# Altium schematic sheet Sheet2.SchDoc
size A; SheetNumber: 1; SheetTotal: 1
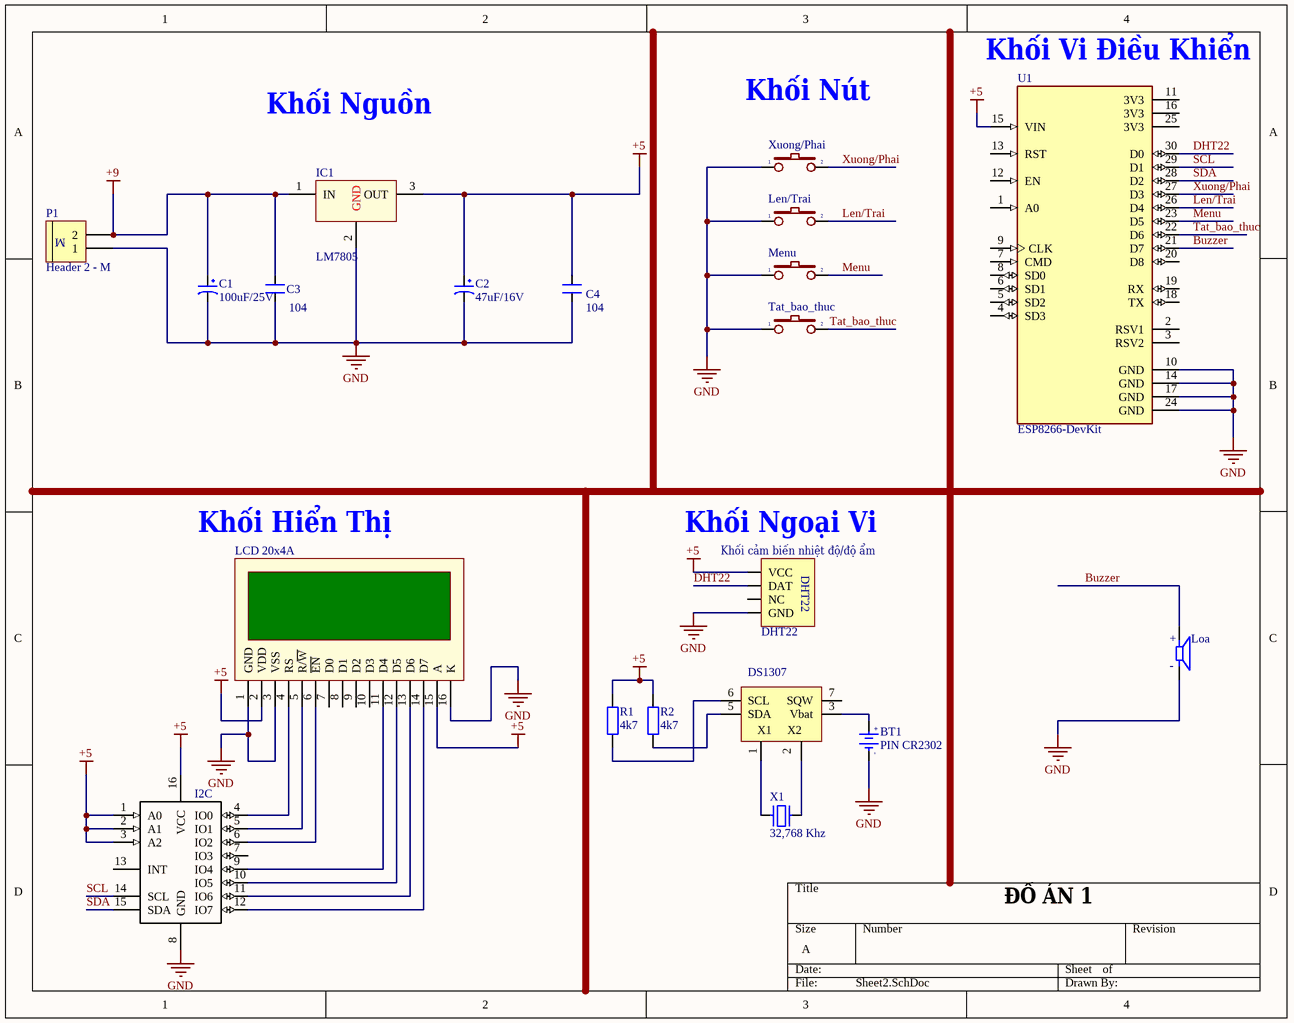
[diagram p0: Sheet2.SchDoc]

## Parts
(Parts that share a designator on the sheet are numbered #1, #2 ... from top to bottom, then left to right.)
?#1  LCD 20x4A  [LCD20X4A]
?#2  DS1307  [DIP8/W0.3]
BT1  PIN CR2302  [PIN3V]
C1  100uF/25V  [CP1.5/3.4]
C2  47uF/16V  [CP1.5/3.4]
C3  104  [CN1]
C4  104  [CN1]
I2C  (no value)  [DIP16]
IC1  LM7805  [QTO-220]
Khối_cảm_biến_nhiệt_độ/độ_ẩm  DHT22  [DHT22]
Len/Trai  (no value)  [SW2]
Loa  (no value)  [Buzzer-12MM]
Menu  (no value)  [SW2]
P1  Header 2 - M  [Medium - Header 2]
R1  4k7  [R1/4W]
R2  4k7  [R1/4W]
Tat_bao_thuc  (no value)  [SW2]
U1  ESP8266-DevKit  [ESP8266-DEVKIT]
X1  32,768 Khz  [XT32k]
Xuong/Phai  (no value)  [SW2]

## Nets
+5: ?#1.2(VDD) ?#1.15(A) C2.1 C4.1 I2C.1(A0) I2C.2(A1) I2C.3(A2) I2C.16(VCC) IC1.3(OUT) Khối_cảm_biến_nhiệt_độ/độ_ẩm.1(VCC) R1.2 R2.2 U1.15(VIN)
+9: C1.1 C3.1 IC1.1(IN) P1.2
GND: ?#1.1(GND) ?#1.3(VSS) ?#1.16(K) ?#2.4(GND) BT1.2(GND) C1.2 C2.2 C3.2 C4.2 I2C.8(GND) IC1.2(GND) Khối_cảm_biến_nhiệt_độ/độ_ẩm.4(GND) Len/Trai.1 Loa.2(M) Menu.1 P1.1 Tat_bao_thuc.1 U1.10(GND) U1.14(GND) U1.17(GND) U1.24(GND) Xuong/Phai.1
VCC: ?#2.8(VCC)
Buzzer: Loa.1(P) U1.21(D7)
DHT22: Khối_cảm_biến_nhiệt_độ/độ_ẩm.2(DAT) U1.30(D0)
Len/Trai: Len/Trai.2 U1.26(D4)
Menu: Menu.2 U1.23(D5)
SCL: I2C.14(SCL) U1.29(D1)
SDA: I2C.15(SDA) U1.28(D2)
Tat_bao_thuc: Tat_bao_thuc.2 U1.22(D6)
Xuong/Phai: U1.27(D3) Xuong/Phai.2
Net?#1_4: ?#1.4(RS) I2C.4(IO0)
Net?#1_5: ?#1.5(R/~{W}) I2C.5(IO1)
Net?#1_6: ?#1.6(~{EN}) I2C.6(IO2)
Net?#1_11: ?#1.11(D4) I2C.9(IO4)
Net?#1_12: ?#1.12(D5) I2C.10(IO5)
Net?#1_13: ?#1.13(D6) I2C.11(IO6)
Net?#1_14: ?#1.14(D7) I2C.12(IO7)
Net?#2_1: ?#2.1(X1) X1.1
Net?#2_2: ?#2.2(X2) X1.2
Net?#2_3: ?#2.3(Vbat) BT1.1(+3V)
Net?#2_5: ?#2.5(SDA) R2.1
Net?#2_6: ?#2.6(SCL) R1.1

Not connected (* = marked no-connect by the designer): ?#1 7(D0) 8(D1) 9(D2) 10(D3); ?#2 7(SQW); I2C 7(IO3) 13(INT); Khối_cảm_biến_nhiệt_độ/độ_ẩm 3(NC); U1 1(A0) 2(RSV1) 3(RSV2) 4(SD3) 5(SD2) 6(SD1) 7(CMD) 8(SD0) 9(CLK) 11(3V3) 12(EN) 13(RST) 16(3V3) 18(TX) 19(RX) 20(D8) 25(3V3)

## Notes on the sheet
- (near U1) Khối Vi Điều Khiển
- Khối Nguồn
- Khối Nút Nhấn
- Khối Hiển Thị
- (near Khối_cảm_biến_nhiệt_độ/độ_ẩm) Khối Ngoại Vi
- Khối Loa
- ĐỒ ÁN 1
- (in symbol Buzzer) +; -
- (in symbol Header 2 - M) M
- (in symbol PIN 3V) +; -

## Library data of the parts
?#1 = LCD20x4A: LCD dipslay 20 char, 4 line; Value: Jum 40; Value: LCD 20x4A
?#2 = DS1307: Real Timer Serial; Value: DS1307
BT1 = PIN 3V: Battery 3VDC; Value: PIN 3V
C1 C2 = CP3: Cap 100uF/35V - 470uF/16V; Value: 100uF/35V/50V; Description 1: 1000uF/6,3V - 470uF/16V - 330uF - 25V; Description 2: 220uF/35V - 100uF/50V - 63V - 4,7uF/200V; Description 3: 22uF => 33uF100V - 3,3uF => 4,7uF/250V; Description 4: 2,2uF =>3,3uF/350 - 2,2uF/400V - 1uF/450V
C3 C4 = CN1: Cap np  1pF - 472pF; Value: 100pF
I2C = PCF8574: I2C PORT EXPANDER; Manufacturer Part Number: PCF8574T/3,512; Manufacturer: NXP Semiconductors; Includes: POR; Interface: I²C; Interrupt Output: Yes; Number of I /O: 8; Voltage - Supply: 2.5 V ~ 6 V; Frequency - Clock: 100KHz; Supplier 1: Digi-Key; Supplier Part Number 1: 568-1076-5-ND; Package / Case: 16-SOIC (7.5mm Width); Category: Integrated Circuits (ICs); Supplier Part Number: 568-1076-5-ND; Operating Temperature: -40°C ~ 85°C; Packaging: Tube; RoHS: RoHS Compliant; Supplier: Digi-Key
IC1 = LM78xx: On ap +, from + 5 to + 24VDC; Value: LM7805
Khối_cảm_biến_nhiệt_độ/độ_ẩm = DHT22: Manufacturer: W¨¹rth Elektronik eiSos GmbH; partNo: 613004143121; ComponentLink1 Description: Manufacturer; ComponentLink2 Description: Datasheet; NoPins: 04; Created Date: 29 March 2013; ComponentLink1URL: http://www.we-online.com; ComponentLink2URL: http://katalog.we-online.de/em/datasheet/6130xx143121.pdf; Created by: Karrer Zheng
Len/Trai Menu Tat_bao_thuc Xuong/Phai = SW2: Switch button 2 pin; Value: SW chip 2 pin
Loa = Buzzer: MP: CST-951AP; Availability: Unavailable; Price: None; Value: *; Package: None
P1 = Header 2 - M: Header, 2-Pin, Medium; LatestRevisionDate: 17-Jul-2002; LatestRevisionNote: Re-released for DXP Platform.; Publisher: Altium Limited
R1 R2 = R1/4W: Resistor 1/4W; Value: R1/4W - 1K
U1 = ESP8266-DevKit: NodeMcu Lua ESP8266 WIFI Internet of Things Network Development Module Board; MF: YKS; MP: ZC563900; Value: *; SnapEDA_Link: https://www.snapeda.com/parts/ZC563900/YKS/view-part/?ref=snap; Availability: Not in stock; Price: None; Package: None; Check_prices: https://www.snapeda.com/parts/ZC563900/YKS/view-part/?ref=eda
X1 = XT32k: Crystal 32,768kHz for timer real; Value: 32,768khz